# Altium schematic sheet power.SchDoc
size 209 x 297 mm; DocumentNumber: ЮМП.250.213 Э3; SheetNumber: 2; PageSetup: Record=PageOptions|CenterHorizontal=True|CenterVertical=True|PrintScale=1.00|XCorrection=1.00|YCorrection=1.00|PrintKind=1|BorderSize=5000000|LeftOffset=0|BottomOffset=0|Orientation=2|PaperLength=1000|PaperWidth=1000|Scale=100|PaperSource=15|PrintQuality=1200|MediaType=1|DitherType=10|PaperKind=A3|PrintScaleMode=1; Weight: -; ScaleFactor: -; NormInspection: Норм.Контр.
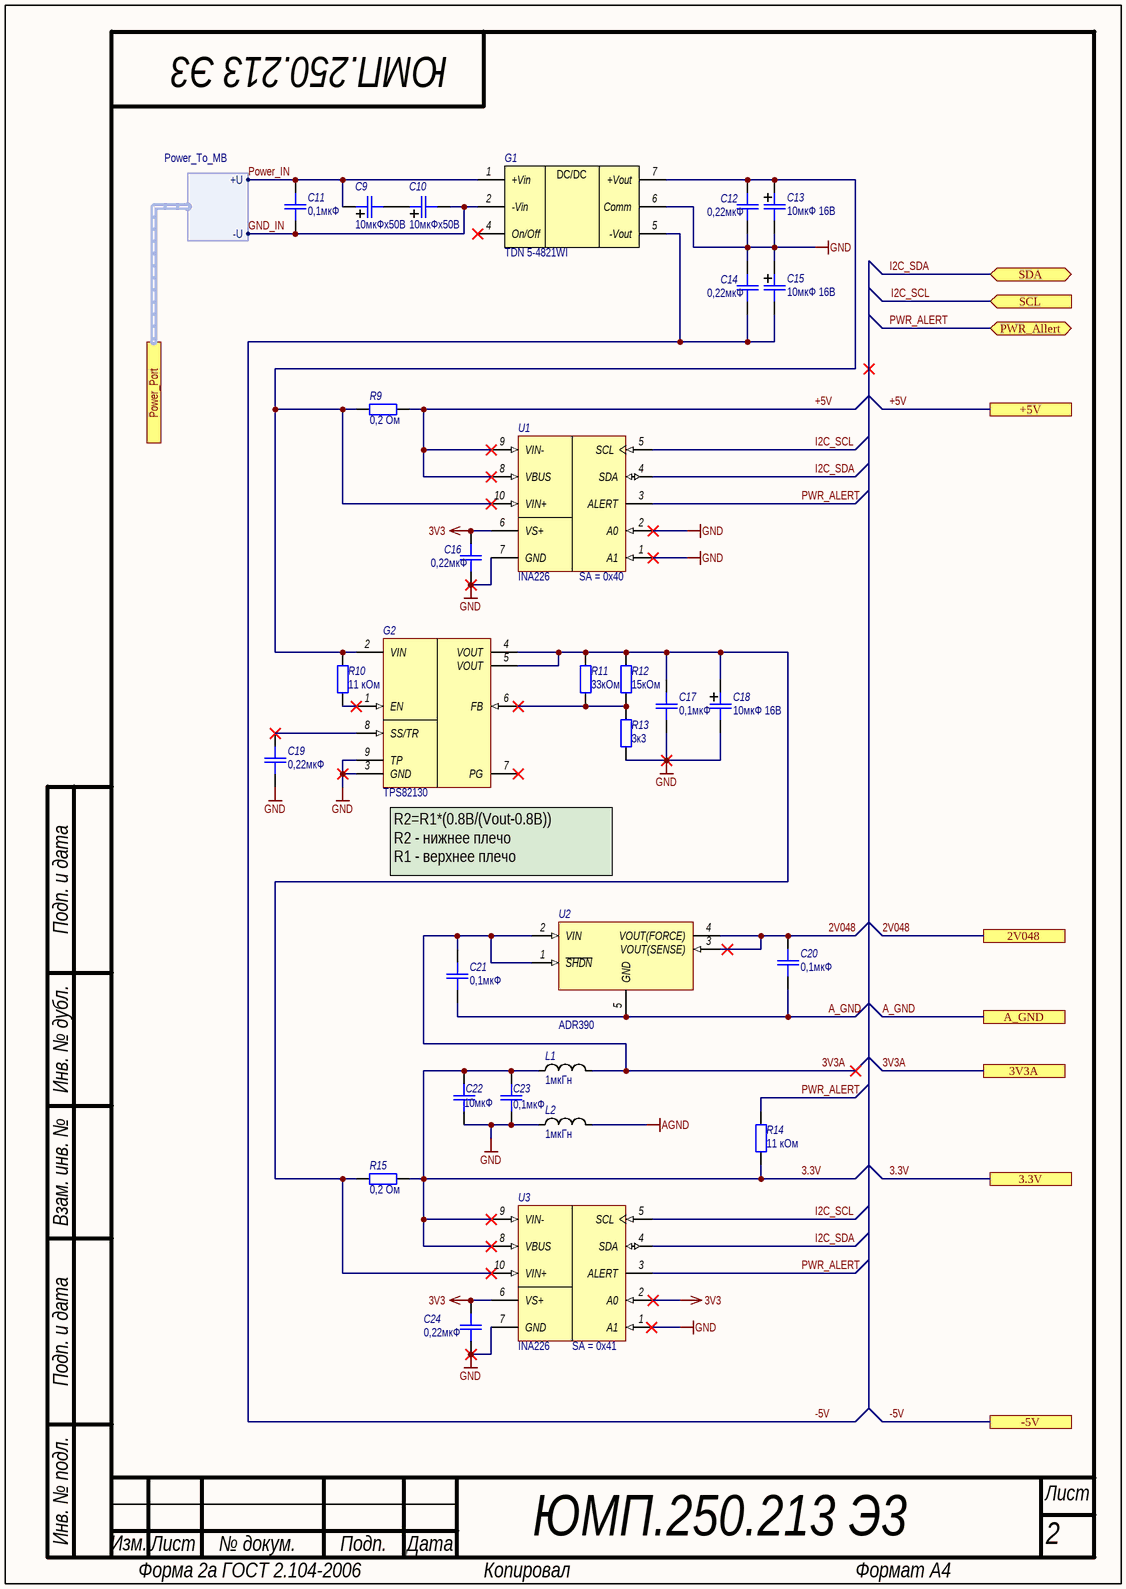
[diagram p0: power.SchDoc]

## Parts
C9  10мкФх50В  [SMD_size_C]
C10  10мкФх50В  [SMD_size_C]
C11  0,1мкФ  [SMD_0805]
C12  0,22мкФ  [SMD_0805]
C13  10мкФ 16В  [SMD_size_B]
C14  0,22мкФ  [SMD_0805]
C15  10мкФ 16В  [SMD_size_B]
C16  0,22мкФ  [SMD_0805]
C17  0,1мкФ  [SMD_0805]
C18  10мкФ 16В  [SMD_size_B]
C19  0,22мкФ  [SMD_0805]
C20  0,1мкФ  [SMD_0805]
C21  0,1мкФ  [SMD_0805]
C22  10мкФ  [SMD_0805]
C23  0,1мкФ  [SMD_0805]
C24  0,22мкФ  [SMD_0805]
G1  Наименование: TDN 5-4821WI  [TDN_5_WISM]  (hidden comment: TDN 5-4821)
G2  TPS82130  [uSiL-8]
L1  1мкГн  [SMD_0805]
L2  1мкГн  [SMD_0805]
R9  0,2 Ом  [SMD_0805]
R10  11 кОм  [SMD_0805]
R11  33кОм  [SMD_0805]
R12  15кОм  [SMD_0805]
R13  3к3  [SMD_0805]
R14  11 кОм  [SMD_0805]
R15  0,2 Ом  [SMD_0805]
U1  INA261  [VSSOP-10]  (value not drawn)
U2  ADR390  [TSOT-5]
U3  INA261  [VSSOP-10]  (value not drawn)

## Ports
2V048, 3.3V, 3V3A, +5V, -5V, A_GND, Power_Port (harness Power_To_MB), PWR_Allert (bidir), SCL (in), SDA (bidir)

## Harnesses
Power_To_MB: +U, -U

## Nets
3V3: C16.2 C24.2 U1.6(VS+) U3.2(A0) U3.6(VS+)
AGND: L2.2
GND: C12.1 C13.2 C14.2 C15.1 C16.1 C17.1 C18.2 C19.1 C22.1 C23.1 C24.1 G1.6(Comm) G2.3(GND) G2.9(TP) L2.1 R13.1 U1.1(A1) U1.2(A0) U1.7(GND) U3.1(A1) U3.7(GND)
2V048: C20.2 U2.3(VOUT(SENSE)) U2.4(VOUT(FORCE)) ; port 2V048
3.3V: C22.2 C23.2 L1.1 R14.1 R15.2 U3.8(VBUS) U3.9(VIN-) ; port 3.3V
3V3A: C21.2 L1.2 U2.1(~{SHDN}) U2.2(VIN) ; port 3V3A
+5V: R9.2 U1.8(VBUS) U1.9(VIN-) ; port +5V
-5V: C14.1 C15.2 G1.5(-Vout) ; port -5V
A_GND: C20.1 C21.1 U2.5(GND) ; port A_GND
GND_IN: C10.2 C11.1 G1.2(-Vin) ; port Power_Port.-U
I2C_SCL: U1.5(SCL) U3.5(SCL) ; port SCL
I2C_SDA: U1.4(SDA) U3.4(SDA) ; port SDA
Power_IN: C9.1 C11.2 G1.1(+Vin) ; port Power_Port.+U
PWR_ALERT: R14.2 U1.3(ALERT) U3.3(ALERT) ; port PWR_Allert
NetC9_2: C9.2 C10.1
NetC12_2: C12.2 C13.1 G1.7(+Vout) G2.2(VIN) R9.1 R10.2 U1.10(VIN+)
NetC17_2: C17.2 C18.1 G2.4(VOUT) G2.5(VOUT) R11.2 R12.2 R15.1 U3.10(VIN+)
NetC19_2: C19.2 G2.8(SS/TR)
NetG2_1: G2.1(EN) R10.1
NetG2_6: G2.6(FB) R11.1 R12.1 R13.2

Not connected (* = marked no-connect by the designer): G1 4(On/Off)*; G2 7(PG)*

## Notes on the sheet
- (near U1) SA = 0x40
- (near G2) R2=R1*(0.8В/(Vout-0.8B))
  R2 - нижнее плечо
  R1 - верхнее плечо
- (near U3) SA = 0x41
- Подп. и дата
- Инв. № дубл.
- Взам. инв. №
- Инв. № подл.
- Изм.
- Лист
- № докум.
- Подп.
- Дата
- Форма 2а ГОСТ 2.104-2006
- Копировал
- Формат А4
- (in symbol TDN_5) DC/DC

## Library data of the parts
C9 C10 = Capacitor_pol: Polarized capacitor; Назначение: Поляризованный SMD-конденсатор; Наименование: Поляризованный конденсатор; Потребление, Вт: 0; Value: 10мкФх50В
C11 C17 C20 C21 C23 = Capacitor: Назначение: SMD-конденсатор; Наименование: Конденсатор; Потребление, Вт: 0; Value: 0,1мкФ
C12 C14 C16 C19 C22 C24 = Capacitor: Назначение: SMD-конденсатор; Наименование: Конденсатор; Потребление, Вт: 0; Value: 0,1мкФ
C13 C15 C18 = Capacitor_pol: Polarized capacitor; Назначение: Поляризованный SMD-конденсатор; Наименование: Поляризованный конденсатор; Потребление, Вт: 0; Value: 10мкФх50В
G1 = TDN_5: DC/DC converter; Назначение: DC-DC преобразователь; Потребление, Вт: 0,01; DataSheet: https://www.tracopower.com/sites/default/files/products/datasheets/tdn5wi_datasheet.pdf
G2 = TPS82130: 17-V Input 3-A Step-Down Converter MicroSiP™ Module with Integrated Inductor; Потребление, Вт: 1,0; ComponentLink1Description: Data sheet; ComponentLink1URL: http://www.ti.com/lit/ds/symlink/tps82130.pdf; Назначение: 17-V Input 3-A Step-Down Converter MicroSiP™ Module with Integrated Inductor; DataSheet: https://www.ti.com/lit/ds/symlink/tps82130.pdf?ts=1592813288219&ref_url=https%253A%252F%252Fwww.google.com%252F; Наименование: TPS82130
L1 L2 = Inductor: Наименование: Индуктивность; Назначение: SMD-индуктивность; Потребление, Вт: 0,010; Value: 1мкГн
R9-R15 = Resistor: Наименование: Резистор; Назначение: SMD-резистор; Потребление, Вт: 0,001; Value: 1к
U1 U3 = INA226: High- or Low-Side Measurement, Bidirectional Current and Power Monitor With I2C Interface; Назначение: High-Side or Low-Side Measurement,; Потребление, Вт: 0,001; ComponentLink1Description: Data sheet; ComponentLink1URL: http://www.ti.com/lit/ds/symlink/ina226.pdf; DataSheet: https://www.ti.com/lit/ds/symlink/ina226.pdf?ts=1592809211957&ref_url=https%253A%252F%252Fwww.google.com%252F; Наименование: INA226
U2 = ADR390: Micropower, Low Noise Precision Voltage Reference with Shutdown, 2.5 V Output, 2.8 to 15 V Supply, Industrial, 5-pin SOT23 (UJ-5), Reel; Потребление, Вт: 0,001; Назначение: Источник опорного напряжения; Наименование: ADR390; DataSheet: https://www.analog.com/media/en/technical-documentation/data-sheets/ADR390.pdf